# Altium schematic sheet Smart_water_dispenser.SchDoc
size A4
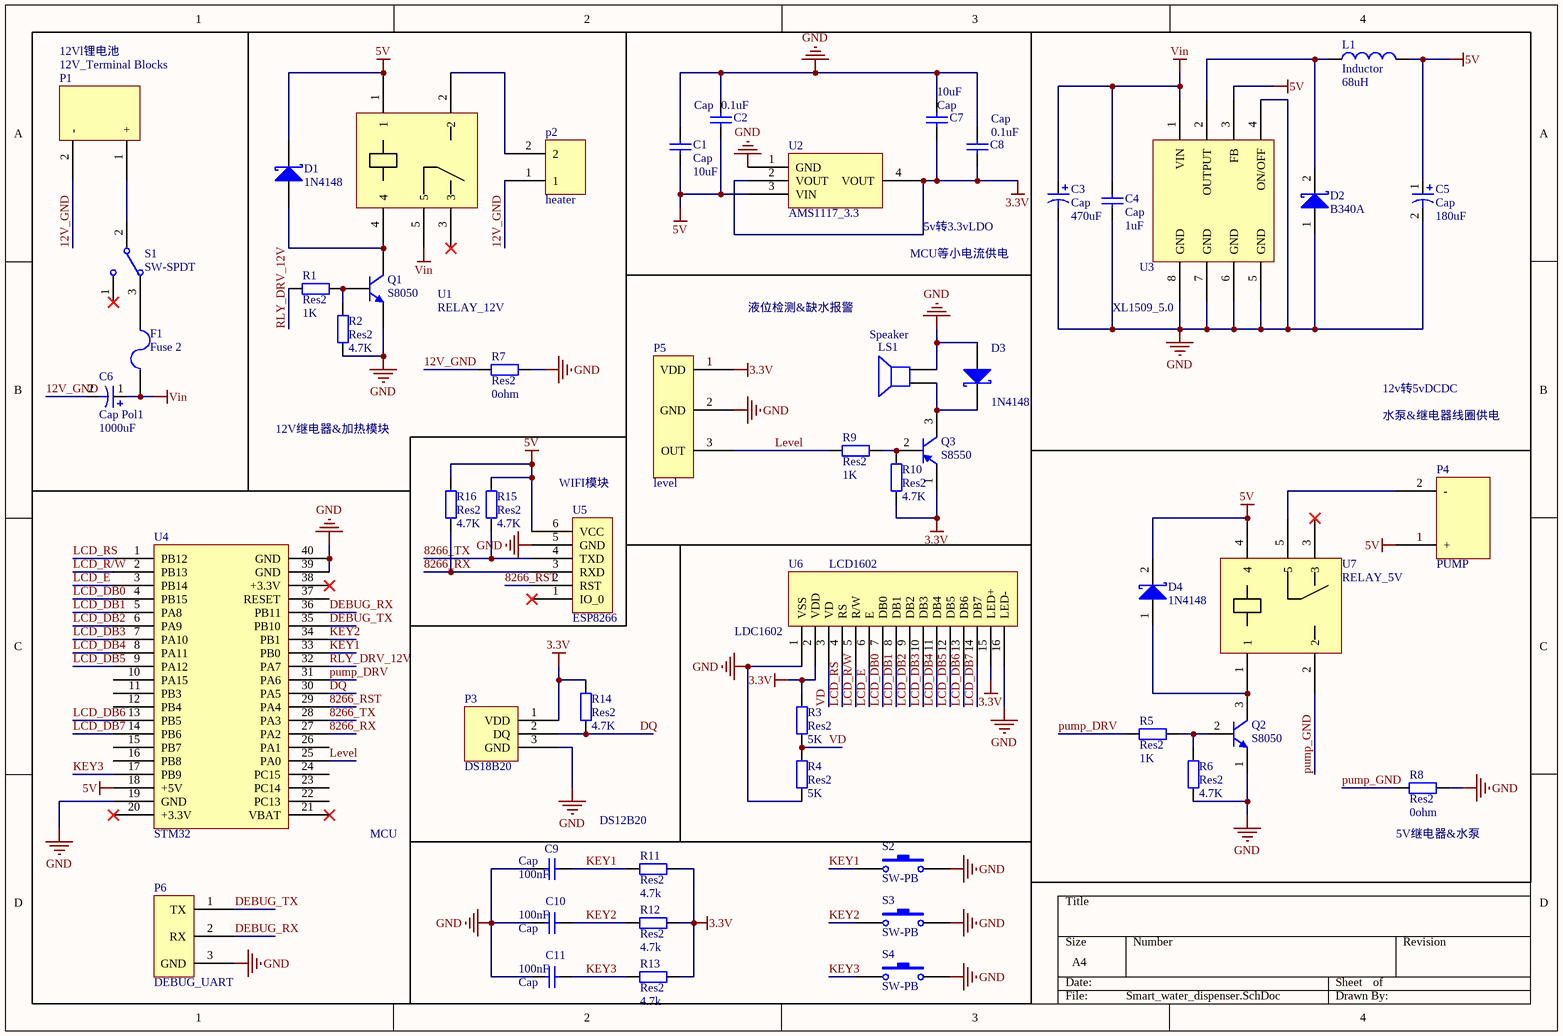
[diagram p0: Smart_water_dispenser.SchDoc]

## Parts
C1  Cap  value 10uF  [0805]
C2  Cap  value 0.1uF  [0805]
C3  Cap  value 470uF  [CAP_TH_BD10]
C4  Cap  value 1uF  [0805]
C5  Cap  value 180uF  [CAP_TH_BD10]
C6  Cap Pol1  value 1000uF  [cap_1000uF]
C7  Cap  value 10uF  [0805]
C8  Cap  value 0.1uF  [0805]
C9  Cap  value 100nF  [0805]
C10  Cap  value 100nF  [0805]
C11  Cap  value 100nF  [0805]
D1  1N4148  [1N4148]
D2  B340A  [B340A]
D3  1N4148  [1N4148]
D4  1N4148  [1N4148]
F1  Fuse 2  [F1812]
L1  Inductor  value 68uH  [IND_CD54]
LS1  Speaker  [buzzer]
P1  12V_Terminal Blocks  [2PIN]
p2  heater  [2PIN]
P3  DS18B20  [DS18B20]
P4  PUMP  [2PIN]
P5  level  [DS18B20]
P6  DEBUG_UART  [DEBUG_UART]
Q1  S8050  [S8050]
Q2  S8050  [S8050]
Q3  S8550  [S8050]
R1  Res2  value 1K  [0805]
R2  Res2  value 4.7K  [0805]
R3  Res2  value 5K  [0805]
R4  Res2  value 5K  [0805]
R5  Res2  value 1K  [0805]
R6  Res2  value 4.7K  [0805]
R7  Res2  value 0ohm  [0805]
R8  Res2  value 0ohm  [0805]
R9  Res2  value 1K  [0805]
R10  Res2  value 4.7K  [0805]
R11  Res2  value 4.7k  [0805]
R12  Res2  value 4.7k  [0805]
R13  Res2  value 4.7k  [0805]
R14  Res2  value 4.7K  [0805]
R15  Res2  value 4.7K  [0805]
R16  Res2  value 4.7K  [0805]
S1  SW-SPDT  [SW]
S2  SW-PB  [SW2]
S3  SW-PB  [SW2]
S4  SW-PB  [SW2]
U1  RELAY_12V  [RELAY]
U2  AMS1117_3.3  [AMS1117]
U3  XL1509_5.0  [XL1509_5.0]
U4  STM32  [STM32]
U5  ESP8266  [ESP8266]
U6  LCD1602  [LCD1602]
U7  RELAY_5V  [RELAY]

## Nets
3.3V: C7.1 C8.1 P3.1(VDD) P5.1(VDD) Q3.1(E) R3.2 R10.1 R11.1 R12.1 R13.1 R14.2 U2.2(VOUT) U2.4(VOUT) U6.2(VDD) U6.15(LED+)
5V: C1.2 C2.1 C5.1 D1.2(K) D4.2(K) L1.2 P4.1(+) R15.2 R16.2 U1.1 U2.3(VIN) U3.3(FB) U4.18(+5V) U5.6(VCC) U7.4
GND: C1.1 C2.2 C3.2 C4.1 C5.2 C7.2 C8.2 C9.1 C10.1 C11.1 D2.1(A) D3.1(A) LS1.2 P3.3(GND) P5.2(GND) P6.3(GND) Q1.1(E) Q2.1(E) R2.1 R4.1 R6.1 R7.2 R8.2 S2.2 S3.2 S4.2 U2.1(GND) U3.4(ON/OFF) U3.5(GND) U3.6(GND) U3.7(GND) U3.8(GND) U4.19(GND) U4.39(GND) U4.40(GND) U5.5(GND) U6.1(VSS) U6.16(LED-)
Vin: C3.1 C4.2 C6.1 F1.1 U1.5 U3.1(VIN)
12V_GND: C6.2 P1.2(-) p2.1 R7.1
8266_RST: U4.29(PA4) U5.2(RST)
8266_RX: R16.1 U4.27(PA2) U5.3(RXD)
8266_TX: R15.1 U4.28(PA3) U5.4(TXD)
DEBUG_RX: P6.2(RX) U4.36(PB11)
DEBUG_TX: P6.1(TX) U4.35(PB10)
DQ: P3.2(DQ) R14.1 U4.30(PA5)
KEY1: C9.2 R11.2 S2.1 U4.33(PB0)
KEY2: C10.2 R12.2 S3.1 U4.34(PB1)
KEY3: C11.2 R13.2 S4.1 U4.17(PB9)
LCD_DB0: U4.4(PB15) U6.7(DB0)
LCD_DB1: U4.5(PA8) U6.8(DB1)
LCD_DB2: U4.6(PA9) U6.9(DB2)
LCD_DB3: U4.7(PA10) U6.10(DB3)
LCD_DB4: U4.8(PA11) U6.11(DB4)
LCD_DB5: U4.9(PA12) U6.12(DB5)
LCD_DB6: U4.13(PB5) U6.13(DB6)
LCD_DB7: U4.14(PB6) U6.14(DB7)
LCD_E: U4.3(PB14) U6.6(E)
LCD_R/W: U4.2(PB13) U6.5(R/W)
LCD_RS: U4.1(PB12) U6.4(RS)
Level: P5.3(OUT) R9.1 U4.25(PA0)
pump_DRV: R5.1 U4.31(PA6)
pump_GND: R8.1 U7.2
RLY_DRV_12V: R1.1 U4.32(PA7)
VD: R3.1 R4.2 U6.3(VD)
NetD1_1: D1.1(A) Q1.3(C) U1.4
NetD2_2: D2.2(K) L1.1 U3.2(OUTPUT)
NetD3_2: D3.2(K) LS1.1 Q3.3(C)
NetD4_1: D4.1(A) Q2.3(C) U7.1
NetF1_2: F1.2 S1.3
NetP1_1: P1.1(+) S1.2
Netp2_2: p2.2 U1.2
NetP4_2: P4.2(-) U7.5
NetQ1_2: Q1.2(B) R1.2 R2.2
NetQ2_2: Q2.2(B) R5.2 R6.2
NetQ3_2: Q3.2(B) R9.2 R10.2

Not connected (* = marked no-connect by the designer): S1 1*; U1 3*; U4 10(PA15) 11(PB3) 12(PB4) 15(PB7) 16(PB8) 20(+3.3V)* 21(VBAT)* 22(PC13) 23(PC14) 24(PC15) 26(PA1) 37(RESET) 38(+3.3V)*; U5 1(IO_0)*; U7 3*

## Notes on the sheet
- 12Vl锂电池
- 5v转3.3vLDO
- 液位检测&缺水报警
- MCU等小电流供电
- 12V继电器&加热模块
- 12v转5vDCDC
- 水泵&继电器线圈供电
- (near U5) WIFI模块
- (near U6) LDC1602
- MCU
- DS12B20
- (near R8) 5V继电器&水泵

## Library data of the parts
C1 C2 C4 C7-C11 = Cap: Capacitor; Published: 8-Jun-2000; LatestRevisionDate: 17-Jul-2002; LatestRevisionNote: Re-released for DXP Platform.; PackageReference: RAD-0.3; Publisher: Altium Limited; PackageDescription: Radial Cap, Thru-Hole; 2 Leads; 0.3 in Pin Spacing
C3 C5 C6 = Cap Pol1: Polarized Capacitor (Radial); Published: 8-Jun-2000; LatestRevisionDate: 17-Jul-2002; LatestRevisionNote: Re-released for DXP Platform.; PackageReference: RB7.6-15; Publisher: Altium Limited; PackageDescription: Polarized Capacitor (Radial); 2 Leads
D1 D3 D4 = D Schottky: Schottky Diode; Published: 8-Jun-2000; LatestRevisionDate: 17-Jul-2002; LatestRevisionNote: Re-released for DXP Platform.; PackageReference: SMB; Publisher: Altium Limited; PackageDescription: DO-214-AA/SMB; 2 C-Bend Leads; Body 5.3 x 3.6 mm, inc. leads (LxW); Code_JEDEC: DO-214-AA
D2 = D Schottky: Schottky Diode; pin to pad: 1>2 2>1; Published: 8-Jun-2000; LatestRevisionDate: 17-Jul-2002; LatestRevisionNote: Re-released for DXP Platform.; PackageReference: SMB; Publisher: Altium Limited; PackageDescription: DO-214-AA/SMB; 2 C-Bend Leads; Body 5.3 x 3.6 mm, inc. leads (LxW); Code_JEDEC: DO-214-AA
F1 = Fuse 2: Fuse; Published: 8-Jun-2000; LatestRevisionDate: 17-Jul-2002; LatestRevisionNote: Re-released for DXP Platform.; PackageReference: PIN-W2/E2.8; Publisher: Altium Limited; PackageDescription: Thru-Hole; 2 Leads
L1 = Inductor: Code_IEC: 1005; Published: 8-Jun-2000; LatestRevisionDate: 29-May-2009; LatestRevisionNote: IPC-7351 Footprint Added.; PackageReference: 0402-A; Publisher: Altium Limited; PackageDescription: Chip Inductor; Code_JEITA: 0402
LS1 = Speaker: Loudspeaker; Published: 24-Mar-1999; LatestRevisionDate: 17-Jul-2002; LatestRevisionNote: Re-released for DXP Platform.; PackageReference: PIN2; Publisher: Altium Limited
Q1 Q2 = 2N3904: NPN General Purpose Amplifier; pin to pad: 1>2 2>1; Published: 8-Jun-2000; LatestRevisionDate: 15-Jan-2003; LatestRevisionNote: PCB Footprint 'BCY-W3/D4.7' replaced; DatasheetVersion: 1997; PackageVersion: Sep-1998; PackageReference: TO-92A; Publisher: Altium Limited; PackageDescription: TO, Flat Index; 3 In-Line, Axial Leads; Body Dia. 4.5mm; Leads 0.51 x 0.48 mm (max); ComponentLink1Description: Manufacturer Link; ComponentLink1URL: http://www.fairchildsemi.com/; ComponentLink2Description: Datasheet; ComponentLink2URL: http://www.fairchildsemi.com/ds/2N%2F2N3904.pdf
Q3 = 2N3906: PNP General Purpose Amplifier; pin to pad: 1>2 2>1; Published: 8-Jun-2000; LatestRevisionDate: 15-Jan-2003; LatestRevisionNote: PCB Footprint 'BCY-W3/D4.7' replaced; DatasheetVersion: 1997; PackageVersion: Sep-1998; PackageReference: TO-92A; Publisher: Altium Limited; PackageDescription: TO, Flat Index; 3 In-Line, Axial Leads; Body Dia. 4.5mm; Leads 0.51 x 0.48 mm (max); ComponentLink1Description: Manufacturer Link; ComponentLink1URL: http://www.fairchildsemi.com/; ComponentLink2Description: Datasheet; ComponentLink2URL: http://www.fairchildsemi.com/ds/2N%2F2N3906.pdf
R1-R16 = Res2: Resistor; Published: 8-Jun-2000; LatestRevisionDate: 17-Jul-2002; LatestRevisionNote: Re-released for DXP Platform.; PackageReference: AXIAL-0.4; Publisher: Altium Limited; PackageDescription: Axial Device, Thru-Hole; 2 Leads; 0.4 in Pin Spacing
S1 = SW-SPDT: SPDT Subminiature Toggle Switch, Right Angle Mounting, Vertical Actuation; Published: 24-Mar-1999; LatestRevisionDate: 17-Dec-2003; LatestRevisionNote: Schematic revised, PCB Footprint replaced.; DatasheetVersion: 05-Dec-2000; PackageReference: TL36WW15050; Publisher: Altium Limited; PackageDescription: Switch; 4 Leads; ComponentLink1Description: Manufacturer Link; ComponentLink1URL: http://www.apem.com
S2-S4 = SW-PB: Switch; Published: 24-Mar-1999; LatestRevisionDate: 17-Jul-2002; LatestRevisionNote: Re-released for DXP Platform.; PackageReference: SPST-2; Publisher: Altium Limited; PackageDescription: Switch; 2 Leads